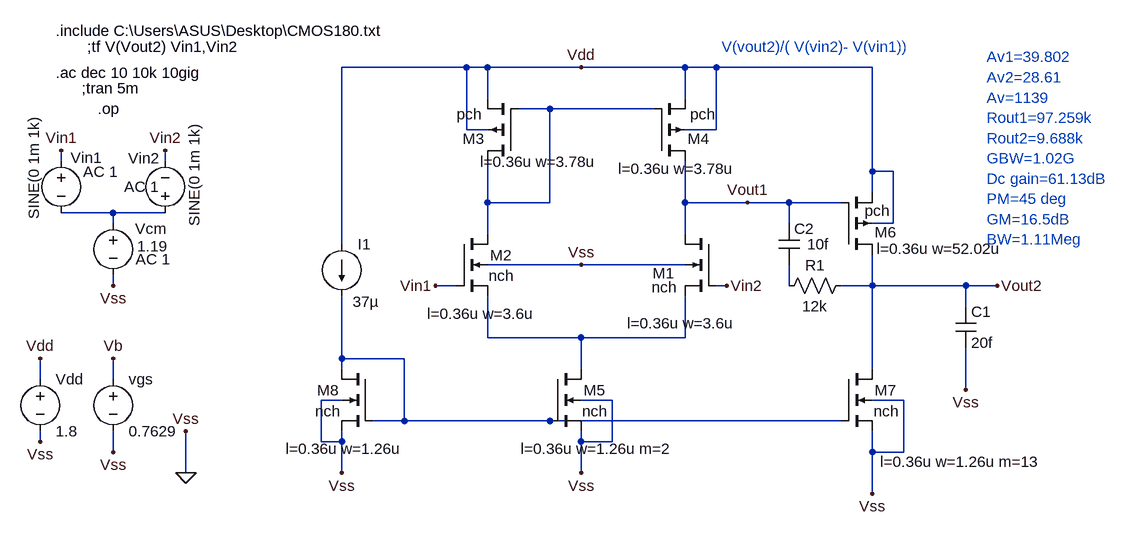
[diagram p0: schematic final design two stage opamp with current mirror.asc]
final design two stage opamp with current mirror.asc, the LTspice schematic file:
Version 4
SHEET 1 1412 680
WIRE 336 -160 144 -160
WIRE 368 -160 336 -160
WIRE 512 -160 368 -160
WIRE 672 -160 512 -160
WIRE 720 -160 672 -160
WIRE 960 -160 720 -160
WIRE 368 -112 368 -160
WIRE 672 -112 672 -160
WIRE 464 -96 416 -96
WIRE 624 -96 464 -96
WIRE 336 -64 336 -160
WIRE 368 -64 336 -64
WIRE 720 -64 720 -160
WIRE 720 -64 672 -64
WIRE -288 -16 -288 -32
WIRE -128 -16 -128 -32
WIRE 960 0 960 -160
WIRE 992 0 960 0
WIRE 960 32 960 0
WIRE 368 48 368 -16
WIRE 464 48 464 -96
WIRE 464 48 368 48
WIRE 672 48 672 -16
WIRE 768 48 672 48
WIRE 832 48 768 48
WIRE 912 48 832 48
WIRE -208 64 -288 64
WIRE -128 64 -208 64
WIRE -208 80 -208 64
WIRE 832 80 832 48
WIRE 992 80 992 0
WIRE 992 80 960 80
WIRE 368 96 368 48
WIRE 672 96 672 48
WIRE 144 112 144 -160
WIRE 512 144 368 144
WIRE 672 144 512 144
WIRE -208 176 -208 160
WIRE 320 176 288 176
WIRE 736 176 720 176
WIRE 832 176 832 144
WIRE 960 176 960 128
WIRE 960 176 912 176
WIRE 1104 176 960 176
WIRE 1152 176 1104 176
WIRE 1104 208 1104 176
WIRE 368 256 368 192
WIRE 512 256 368 256
WIRE 672 256 672 192
WIRE 672 256 512 256
WIRE 144 288 144 192
WIRE 240 288 144 288
WIRE 144 304 144 288
WIRE 512 304 512 256
WIRE 960 304 960 176
WIRE -320 320 -320 288
WIRE -208 320 -208 288
WIRE 1104 336 1104 272
WIRE 144 352 112 352
WIRE 560 352 512 352
WIRE 1008 352 960 352
WIRE 240 384 240 288
WIRE 240 384 192 384
WIRE 464 384 240 384
WIRE 912 384 464 384
WIRE -320 416 -320 400
WIRE 112 416 112 352
WIRE 144 416 144 400
WIRE 144 416 112 416
WIRE 512 416 512 400
WIRE 560 416 560 352
WIRE 560 416 512 416
WIRE -208 432 -208 400
WIRE 960 432 960 400
WIRE 1008 432 1008 352
WIRE 1008 432 960 432
WIRE -96 464 -96 400
WIRE 144 464 144 416
WIRE 512 464 512 416
WIRE 960 496 960 432
FLAG -96 464 0
FLAG -96 400 Vss
FLAG -320 416 Vss
FLAG -208 176 Vss
FLAG -320 288 Vdd
FLAG 736 176 Vin2
FLAG 288 176 Vin1
FLAG 512 -160 Vdd
FLAG 512 144 Vss
FLAG -288 -32 Vin1
FLAG -128 -32 Vin2
FLAG -208 288 Vb
FLAG -208 432 Vss
FLAG 768 48 Vout1
FLAG 512 464 Vss
FLAG 1152 176 Vout2
FLAG 960 496 Vss
FLAG 1104 336 Vss
FLAG 144 464 Vss
SYMBOL nmos4 720 96 M0
WINDOW 0 64 61 Left 2
WINDOW 3 60 82 Left 2
WINDOW 123 -29 138 Left 2
SYMATTR InstName M1
SYMATTR Value nch
SYMATTR Value2 l=0.36u w=3.6u
SYMBOL voltage -320 304 R0
WINDOW 123 0 0 Left 0
WINDOW 39 0 0 Left 0
SYMATTR InstName Vdd
SYMATTR Value 1.8
SYMBOL voltage -208 64 R0
WINDOW 3 37 51 Left 2
WINDOW 123 35 71 Left 2
WINDOW 39 0 0 Left 0
WINDOW 0 34 24 Left 2
SYMATTR Value 1.19
SYMATTR Value2 AC 1
SYMATTR InstName Vcm
SYMBOL pmos4 624 -16 M180
WINDOW 123 -55 -12 Left 2
WINDOW 0 52 34 Left 2
SYMATTR Value2 l=0.36u w=3.78u
SYMATTR InstName M4
SYMATTR Value pch
SYMBOL nmos4 320 96 R0
WINDOW 0 52 33 Left 2
WINDOW 3 50 65 Left 2
WINDOW 123 -45 123 Left 2
SYMATTR InstName M2
SYMATTR Value nch
SYMATTR Value2 l=0.36u w=3.6u
SYMBOL voltage -288 -32 R0
WINDOW 0 15 11 Left 2
WINDOW 3 -42 -52 VRight 2
WINDOW 123 34 33 Left 2
WINDOW 39 0 0 Left 0
SYMATTR InstName Vin1
SYMATTR Value SINE(0 1m 1k)
SYMATTR Value2 AC 1
SYMBOL voltage -128 80 M180
WINDOW 0 -57 100 Left 2
WINDOW 3 45 153 VLeft 2
WINDOW 123 -63 56 Left 2
WINDOW 39 0 0 Left 0
SYMATTR InstName Vin2
SYMATTR Value SINE(0 1m 1k)
SYMATTR Value2 AC 1
SYMBOL voltage -208 304 R0
WINDOW 123 0 0 Left 0
WINDOW 39 0 0 Left 0
SYMATTR InstName vgs
SYMATTR Value 0.7629
SYMBOL pmos4 416 -16 R180
WINDOW 123 -120 -1 Left 2
WINDOW 0 52 34 Left 2
SYMATTR Value2 l=0.36u w=3.78u
SYMATTR InstName M3
SYMATTR Value pch
SYMBOL nmos4 464 304 R0
WINDOW 0 52 33 Left 2
WINDOW 3 50 65 Left 2
WINDOW 123 -45 123 Left 2
SYMATTR InstName M5
SYMATTR Value nch
SYMATTR Value2 l=0.36u w=1.26u m=2
SYMBOL pmos4 912 128 M180
WINDOW 123 55 9 Left 2
WINDOW 0 52 34 Left 2
WINDOW 3 36 67 Left 2
SYMATTR Value2 l=0.36u w=52.02u
SYMATTR InstName M6
SYMATTR Value pch
SYMBOL nmos4 912 304 R0
WINDOW 0 52 33 Left 2
WINDOW 3 50 65 Left 2
WINDOW 123 60 143 Left 2
SYMATTR InstName M7
SYMATTR Value nch
SYMATTR Value2 l=0.36u w=1.26u m=13
SYMBOL cap 1088 208 R0
SYMATTR InstName C1
SYMATTR Value 20f
SYMBOL res 928 160 R90
WINDOW 0 0 56 VBottom 2
WINDOW 3 32 56 VTop 2
SYMATTR InstName R1
SYMATTR Value 12k
SYMBOL cap 816 80 R0
WINDOW 3 44 32 Left 2
SYMATTR Value 10f
SYMATTR InstName C2
SYMBOL nmos4 192 304 M0
WINDOW 0 52 33 Left 2
WINDOW 3 50 65 Left 2
WINDOW 123 -45 123 Left 2
SYMATTR InstName M8
SYMATTR Value nch
SYMATTR Value2 l=0.36u w=1.26u
SYMBOL current 144 112 R0
WINDOW 3 17 89 Left 2
WINDOW 123 0 0 Left 0
WINDOW 39 0 0 Left 0
SYMATTR InstName I1
SYMATTR Value 37µ
TEXT -296 -216 Left 2 !.include C:\\Users\\ASUS\\Desktop\\CMOS180.txt
TEXT -232 -96 Left 2 !.op
TEXT -248 -192 Left 2 !;tf V(Vout2) Vin1,Vin2
TEXT -296 -152 Left 2 !.ac dec 10 10k 10gig
TEXT -256 -128 Left 2 !;tran 5m
TEXT 728 -192 Left 2 ;V(vout2)/( V(vin2)- V(vin1))
TEXT 1136 -176 Left 2 ;Av1=39.802\nAv2=28.61\nAv=1139\nRout1=97.259k\nRout2=9.688k\nGBW=1.02G\nDc gain=61.13dB\nPM=45 deg\nGM=16.5dB\nBW=1.11Meg

The netlist it stands for:
* final design two stage opamp with current mirror.asc
M1 Vout1 Vin2 N004 0 nch l=0.36u w=3.6u
Vdd Vdd 0 1.8
Vcm N002 0 1.19 AC 1
M4 Vout1 N001 Vdd Vdd pch l=0.36u w=3.78u
M2 N001 Vin1 N004 0 nch l=0.36u w=3.6u
Vin1 Vin1 N002 SINE(0 1m 1k) AC 1
Vin2 N002 Vin2 SINE(0 1m 1k) AC 1
vgs Vb 0 0.7629
M3 N001 N001 Vdd Vdd pch l=0.36u w=3.78u
M5 N004 N005 0 0 nch l=0.36u w=1.26u m=2
M6 Vout2 Vout1 Vdd Vdd pch l=0.36u w=52.02u
M7 Vout2 N005 0 0 nch l=0.36u w=1.26u m=13
C1 Vout2 0 20f
R1 Vout2 N003 12k
C2 Vout1 N003 10f
M8 N005 N005 0 0 nch l=0.36u w=1.26u
I1 Vdd N005 37µ
.model NMOS NMOS
.model PMOS PMOS
.lib standard.mos
.include C:\Users\ASUS\Desktop\CMOS180.txt
.op
;tf V(Vout2) Vin1,Vin2
.ac dec 10 10k 10gig
;tran 5m
* V(vout2)/( V(vin2)- V(vin1))
* Av1=39.802
* Av2=28.61
* Av=1139
* Rout1=97.259k
* Rout2=9.688k
* GBW=1.02G
* Dc gain=61.13dB
* PM=45 deg
* GM=16.5dB
* BW=1.11Meg
.backanno
.end